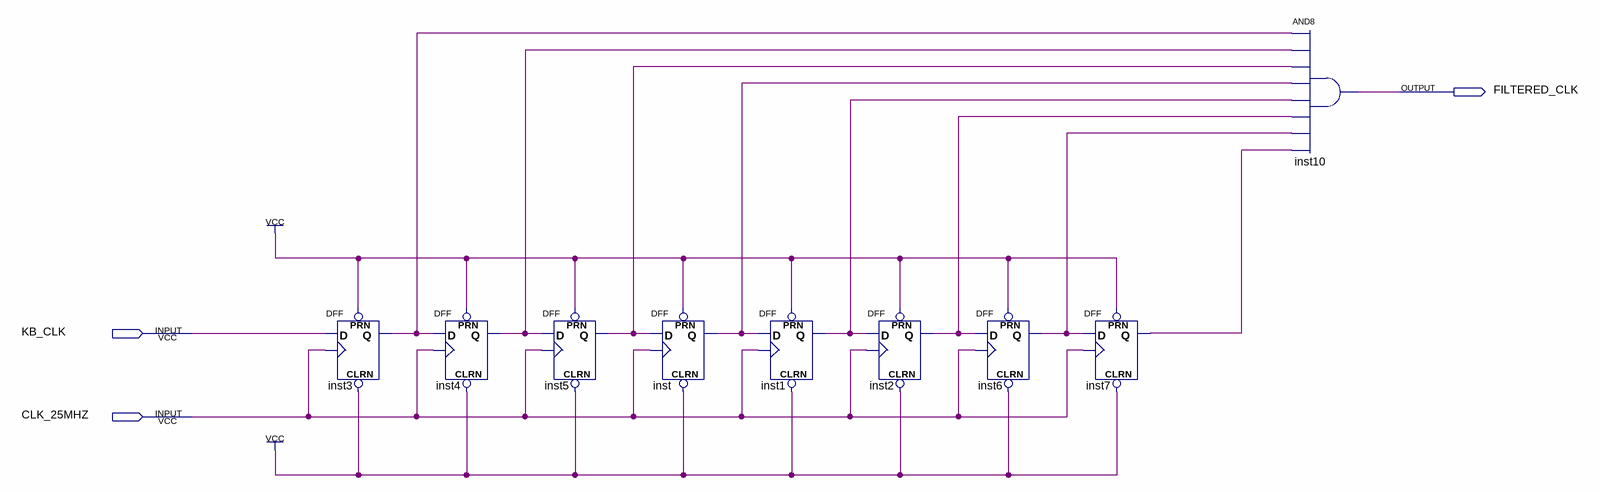
[diagram p0: schematic sheet]
// Quartus schematic CLK_FILTER.bdf as structural Verilog: 9 symbols, 3 pins
module CLK_FILTER (
  input  KB_CLK,
  input  CLK_25MHZ,
  output FILTERED_CLK
);

  wire inst1_q, inst2_q, inst3_q, inst4_q, inst5_q, inst6_q, inst7_q, inst_q;

  DFF inst3 (.CLRN(1'b1), .CLK(CLK_25MHZ), .D(KB_CLK), .PRN(1'b1), .Q(inst3_q));
  DFF inst4 (.CLRN(1'b1), .CLK(CLK_25MHZ), .D(inst3_q), .PRN(1'b1), .Q(inst4_q));
  DFF inst5 (.CLRN(1'b1), .CLK(CLK_25MHZ), .D(inst4_q), .PRN(1'b1), .Q(inst5_q));
  DFF inst (.CLRN(1'b1), .CLK(CLK_25MHZ), .D(inst5_q), .PRN(1'b1), .Q(inst_q));
  DFF inst1 (.CLRN(1'b1), .CLK(CLK_25MHZ), .D(inst_q), .PRN(1'b1), .Q(inst1_q));
  DFF inst2 (.CLRN(1'b1), .CLK(CLK_25MHZ), .D(inst1_q), .PRN(1'b1), .Q(inst2_q));
  DFF inst6 (.CLRN(1'b1), .CLK(CLK_25MHZ), .D(inst2_q), .PRN(1'b1), .Q(inst6_q));
  DFF inst7 (.CLRN(1'b1), .CLK(CLK_25MHZ), .D(inst6_q), .PRN(1'b1), .Q(inst7_q));
  and inst10 (FILTERED_CLK, inst3_q, inst4_q, inst5_q, inst_q, inst1_q, inst2_q, inst6_q, inst7_q);
endmodule
